# EAGLE design Noctua2 (EAGLE 9.6.2)
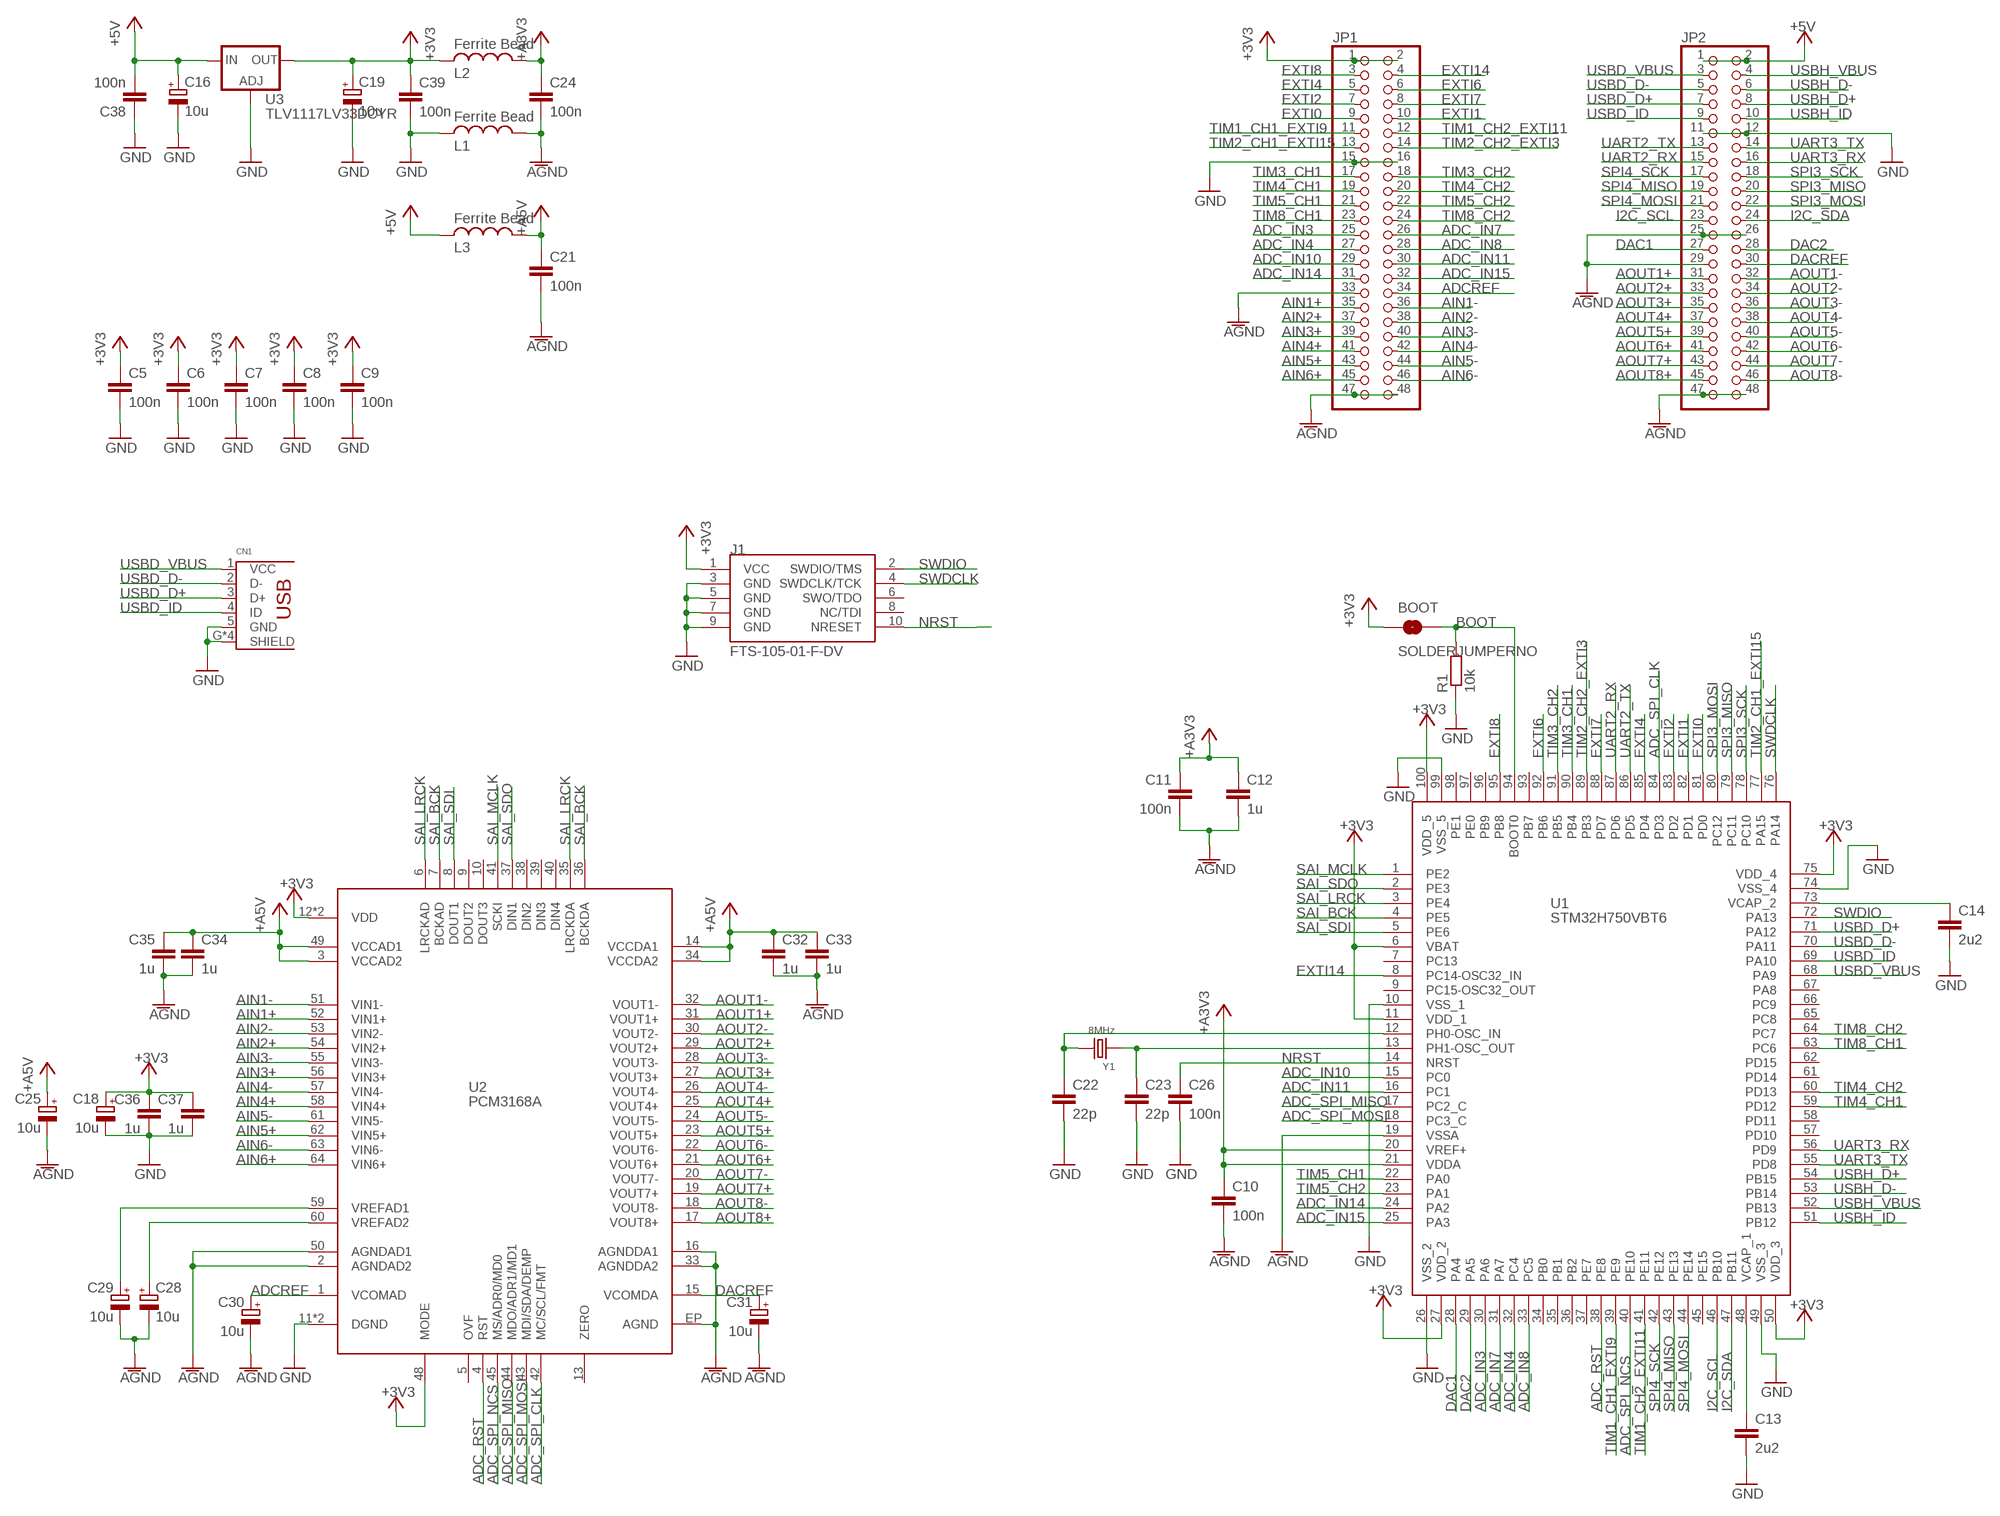
[diagram p0: schematic, sheet 1]

## Parts
BOOT  SOLDERJUMPERNO  [SJ_2S-NO]
C5  100n  C-EUC0603  [C0603]
C6  100n  C-EUC0603  [C0603]
C7  100n  C-EUC0603  [C0603]
C8  100n  C-EUC0603  [C0603]
C9  100n  C-EUC0603  [C0603]
C10  100n  C-EUC0603  [C0603]
C11  100n  C-EUC0603  [C0603]
C12  1u  C-EUC0603  [C0603]
C13  2u2  C-EUC0603  [C0603]
C14  2u2  C-EUC0603  [C0603]
C16  10u  CPOL-EUUD-4X5,8  [UD-4X5,8_NICHICON]
C18  10u  CPOL-EUUD-4X5,8  [UD-4X5,8_NICHICON]
C19  10u  CPOL-EUUD-4X5,8  [UD-4X5,8_NICHICON]
C21  100n  C-EUC0603  [C0603]
C22  22p  C-EUC0603  [C0603]
C23  22p  C-EUC0603  [C0603]
C24  100n  C-EUC0603  [C0603]
C25  10u  CPOL-EUUD-4X5,8  [UD-4X5,8_NICHICON]
C26  100n  C-EUC0603  [C0603]
C28  10u  CPOL-EUUD-4X5,8  [UD-4X5,8_NICHICON]
C29  10u  CPOL-EUUD-4X5,8  [UD-4X5,8_NICHICON]
C30  10u  CPOL-EUUD-4X5,8  [UD-4X5,8_NICHICON]
C31  10u  CPOL-EUUD-4X5,8  [UD-4X5,8_NICHICON]
C32  1u  C-EUC0603  [C0603]
C33  1u  C-EUC0603  [C0603]
C34  1u  C-EUC0603  [C0603]
C35  1u  C-EUC0603  [C0603]
C36  1u  C-EUC0603  [C0603]
C37  1u  C-EUC0603  [C0603]
C38  100n  C-EUC0603  [C0603]
C39  100n  C-EUC0603  [C0603]
CN1  USB_HRS_ZX62-B-5PA(11)MICRO.B  [HRS_ZX62RD-AB-5P8]
J1  FTS-105-01-F-DV  ARM_10SMD  [2X5_1.27MM_SMD]
JP1  PINHD-2X24  [2X24]
JP2  PINHD-2X24  [2X24]
L1  Ferrite Bead  INDUCTOR  [0603]
L2  Ferrite Bead  INDUCTOR  [0603]
L3  Ferrite Bead  INDUCTOR  [0603]
R1  10k  R-EU_0603  [0603@1]
U1  STM32H750VBT6  [QFP50P1600X1600X160-100N]
U2  PCM3168A  [PQFP64]
U3  TLV1117LV33DCYR  LD117AS33TR  [SOT223]
Y1  8MHz  SMD-CRYSTAL-8MHZ-20PF-20PPM(2P-5.0X3.2MM)  [X2-SMD-5.0X3.2X1.3MM]

## Nets
+3V3: BOOT.1 C5.1 C6.1 C7.1 C8.1 C9.1 C18.+ C19.+ C36.1 C37.1 C39.1 J1.1(VCC) JP1.1 JP1.2 L2.2 U1.6(VBAT) U1.11(VDD_1) U1.27(VDD_2) U1.50(VDD_3) U1.75(VDD_4) U1.100(VDD_5) U2.12(VDD) U2.46(VDD) U2.48(MODE) U3.4(OUT)
+5V: C16.+ C38.2 JP2.1 JP2.2 L3.2 U3.3(IN)
+A3V3: C10.1 C11.1 C12.1 C24.1 L2.1 U1.20(VREF+) U1.21(VDDA)
+A5V: C21.1 C25.+ C32.1 C33.1 C34.1 C35.1 L3.1 U2.3(VCCAD2) U2.14(VCCDA1) U2.34(VCCDA2) U2.49(VCCAD1)
ADC_IN3: JP1.25 U1.30(PA6)
ADC_IN4: JP1.27 U1.32(PC4)
ADC_IN7: JP1.26 U1.31(PA7)
ADC_IN8: JP1.28 U1.33(PC5)
ADC_IN10: JP1.29 U1.15(PC0)
ADC_IN11: JP1.30 U1.16(PC1)
ADC_IN14: JP1.31 U1.24(PA2)
ADC_IN15: JP1.32 U1.25(PA3)
ADC_RST: U1.38(PE8) U2.4(RST)
ADC_SPI_CLK: U1.84(PD3) U2.42(MC/SCL/FMT)
ADC_SPI_MISO: U1.17(PC2_C) U2.44(MDO/ADR1/MD1)
ADC_SPI_MOSI: U1.18(PC3_C) U2.43(MDI/SDA/DEMP)
ADC_SPI_NCS: U1.40(PE10) U2.45(MS/ADR0/MD0)
ADCREF: C30.+ JP1.34 U2.1(VCOMAD)
AGND: C10.2 C11.2 C12.2 C21.2 C24.2 C25.- C28.- C29.- C30.- C31.- C32.2 C33.2 C34.2 C35.2 JP1.33 JP1.47 JP1.48 JP2.25 JP2.26 JP2.29 JP2.47 JP2.48 L1.1 U1.19(VSSA) U2.2(AGNDAD2) U2.16(AGNDDA1) U2.33(AGNDDA2) U2.50(AGNDAD1) U2.EP(AGND)
AIN1+: JP1.35 U2.52(VIN1+)
AIN1-: JP1.36 U2.51(VIN1-)
AIN2+: JP1.37 U2.54(VIN2+)
AIN2-: JP1.38 U2.53(VIN2-)
AIN3+: JP1.39 U2.56(VIN3+)
AIN3-: JP1.40 U2.55(VIN3-)
AIN4+: JP1.41 U2.58(VIN4+)
AIN4-: JP1.42 U2.57(VIN4-)
AIN5+: JP1.43 U2.62(VIN5+)
AIN5-: JP1.44 U2.61(VIN5-)
AIN6+: JP1.45 U2.64(VIN6+)
AIN6-: JP1.46 U2.63(VIN6-)
AOUT1+: JP2.31 U2.31(VOUT1+)
AOUT1-: JP2.32 U2.32(VOUT1-)
AOUT2+: JP2.33 U2.29(VOUT2+)
AOUT2-: JP2.34 U2.30(VOUT2-)
AOUT3+: JP2.35 U2.27(VOUT3+)
AOUT3-: JP2.36 U2.28(VOUT3-)
AOUT4+: JP2.37 U2.25(VOUT4+)
AOUT4-: JP2.38 U2.26(VOUT4-)
AOUT5+: JP2.39 U2.23(VOUT5+)
AOUT5-: JP2.40 U2.24(VOUT5-)
AOUT6+: JP2.41 U2.21(VOUT6+)
AOUT6-: JP2.42 U2.22(VOUT6-)
AOUT7+: JP2.43 U2.19(VOUT7+)
AOUT7-: JP2.44 U2.20(VOUT7-)
AOUT8+: JP2.45 U2.17(VOUT8+)
AOUT8-: JP2.46 U2.18(VOUT8-)
BOOT: BOOT.2 R1.2 U1.94(BOOT0)
DAC1: JP2.27 U1.28(PA4)
DAC2: JP2.28 U1.29(PA5)
DACREF: C31.+ JP2.30 U2.15(VCOMDA)
EXTI0: JP1.9 U1.81(PD0)
EXTI1: JP1.10 U1.82(PD1)
EXTI2: JP1.7 U1.83(PD2)
EXTI4: JP1.5 U1.85(PD4)
EXTI6: JP1.6 U1.92(PB6)
EXTI7: JP1.8 U1.88(PD7)
EXTI8: JP1.3 U1.95(PB8)
EXTI14: JP1.4 U1.8(PC14-OSC32_IN)
GND: C5.2 C6.2 C7.2 C8.2 C9.2 C13.2 C14.2 C16.- C18.- C19.- C22.2 C23.2 C26.2 C36.2 C37.2 C38.1 C39.2 CN1.5(GND) CN1.G2(SHIELD) CN1.G3(SHIELD) CN1.G4(SHIELD) CN1.G(SHIELD) J1.3(GND) J1.5(GND) J1.7(GND) J1.9(GND) JP1.15 JP1.16 JP2.11 JP2.12 L1.2 R1.1 U1.10(VSS_1) U1.26(VSS_2) U1.49(VSS_3) U1.74(VSS_4) U1.99(VSS_5) U2.11(DGND) U2.47(DGND) U3.1(ADJ)
I2C_SCL: JP2.23 U1.46(PB10)
I2C_SDA: JP2.24 U1.47(PB11)
N$2: C28.+ U2.60(VREFAD2)
N$6: C13.1 U1.48(VCAP_1)
N$12: C23.1 U1.13(PH1-OSC_OUT) Y1.1
N$15: C22.1 U1.12(PH0-OSC_IN) Y1.2
N$19: C14.1 U1.73(VCAP_2)
NRST: C26.1 J1.10(NRESET) U1.14(NRST)
SAI_BCK: U1.4(PE5) U2.7(BCKAD) U2.36(BCKDA)
SAI_LRCK: U1.3(PE4) U2.6(LRCKAD) U2.35(LRCKDA)
SAI_MCLK: U1.1(PE2) U2.41(SCKI)
SAI_SDI: U1.5(PE6) U2.8(DOUT1)
SAI_SDO: U1.2(PE3) U2.37(DIN1)
SPI3_MISO: JP2.20 U1.79(PC11)
SPI3_MOSI: JP2.22 U1.80(PC12)
SPI3_SCK: JP2.18 U1.78(PC10)
SPI4_MISO: JP2.19 U1.43(PE13)
SPI4_MOSI: JP2.21 U1.44(PE14)
SPI4_SCK: JP2.17 U1.42(PE12)
SWDCLK: J1.4(SWDCLK/TCK) U1.76(PA14)
SWDIO: J1.2(SWDIO/TMS) U1.72(PA13)
TIM1_CH1_EXTI9: JP1.11 U1.39(PE9)
TIM1_CH2_EXTI11: JP1.12 U1.41(PE11)
TIM2_CH1_EXTI15: JP1.13 U1.77(PA15)
TIM2_CH2_EXTI3: JP1.14 U1.89(PB3)
TIM3_CH1: JP1.17 U1.90(PB4)
TIM3_CH2: JP1.18 U1.91(PB5)
TIM4_CH1: JP1.19 U1.59(PD12)
TIM4_CH2: JP1.20 U1.60(PD13)
TIM5_CH1: JP1.21 U1.22(PA0)
TIM5_CH2: JP1.22 U1.23(PA1)
TIM8_CH1: JP1.23 U1.63(PC6)
TIM8_CH2: JP1.24 U1.64(PC7)
UART2_RX: JP2.15 U1.87(PD6)
UART2_TX: JP2.13 U1.86(PD5)
UART3_RX: JP2.16 U1.56(PD9)
UART3_TX: JP2.14 U1.55(PD8)
USBD_D+: CN1.3(D+) JP2.7 U1.71(PA12)
USBD_D-: CN1.2(D-) JP2.5 U1.70(PA11)
USBD_ID: CN1.4(ID) JP2.9 U1.69(PA10)
USBD_VBUS: CN1.1(VCC) JP2.3 U1.68(PA9)
USBH_D+: JP2.8 U1.54(PB15)
USBH_D-: JP2.6 U1.53(PB14)
USBH_ID: JP2.10 U1.51(PB12)
USBH_VBUS: JP2.4 U1.52(PB13)
VREF_ADC: C29.+ U2.59(VREFAD1)
Unconnected: J1.6(SWO/TDO) J1.8(NC/TDI) U1.7(PC13) U1.9(PC15-OSC32_OUT) U1.34(PB0) U1.35(PB1) U1.36(PB2) U1.37(PE7) U1.45(PE15) U1.57(PD10) U1.58(PD11) U1.61(PD14) U1.62(PD15) U1.65(PC8) U1.66(PC9) U1.67(PA8) U1.93(PB7) U1.96(PB9) U1.97(PE0) U1.98(PE1) U2.5(OVF) U2.9(DOUT2) U2.10(DOUT3) U2.13(ZERO) U2.38(DIN2) U2.39(DIN3) U2.40(DIN4)

## Library data of the parts
BOOT = SparkFun:SOLDERJUMPER: Solder Jumper Standard SMD solder jumper. Used to automate production. Two varients : Normally Open and Normally Closed are the same, but have different paste layers. NC will have a large amount of paste and should jumper during reflow.
C5-C14 C21-C24 C26 C32-C39 = Rebel:C-EU: CAPACITOR, European symbol
C16 C18 C19 C25 C28-C31 = Rebel:CPOL-EU: POLARIZED CAPACITOR, European symbol
CN1 = Rebel:USB_HRS_ZX62-B-5PA(11)MICRO.B
J1 = borkedlabs-connectors:ARM_10; PACKAGE: 2x5_1.27MM_SMD
JP1 JP2 = pinhead:PINHD-2X24: PIN HEADER
L1-L3 = Rebel:INDUCTOR; OC_FARNELL: 2288736
R1 = Rebel:R-EU_: RESISTOR, European symbol
U1 = SamacSys_Parts:STM32H750VBT6: ARM Microcontrollers - MCU High-performance and DSP with DP-FPU, Arm Cortex-M7 MCU with 128 Kbytes of Flash memory, 1MB RAM, 400 MHz CPU, L1 cache, external memory interface, JPEG codec, HW crypto, large set of peripherals Source: Datasheet <https://www.st.com/resource/en/datasheet/stm32h750vb.pdf>; DESCRIPTION: ARM Microcontrollers - MCU High-performance and DSP with DP-FPU, Arm Cortex-M7 MCU with 128 Kbytes of Flash memory, 1MB RAM, 400 MHz CPU, L1 cache, external memory interface, JPEG codec, HW crypto, large set of peripherals; HEIGHT: 1.6mm; MANUFACTURER_NAME: STMicroelectronics; MANUFACTURER_PART_NUMBER: STM32H750VBT6; MOUSER_PART_NUMBER: 511-STM32H750VBT6; MOUSER_PRICE-STOCK: https://www.mouser.com/Search/Refine.aspx?Keyword=511-STM32H750VBT6
U2 = Rebel:PCM3168A
U3 = v-reg:LD117A?*: Low drop fixed and adjustable positive voltage regulators 1 A Source: http://www.st.com/stonline/products/literature/ds/7194/ld1117axx.pdf
Y1 = Seeed-OPL-crystal-osctllator:SMD-CRYSTAL-8MHZ-20PF-20PPM(2P-5.0X3.2MM): 306010004; MPN: 5032/2P; VALUE: 5032/2p

## Net classes
1 power: width 0.178 mm, drill 0.305 mm, clearance 0.178 mm to class 0, clearance 0.178 mm

## Board
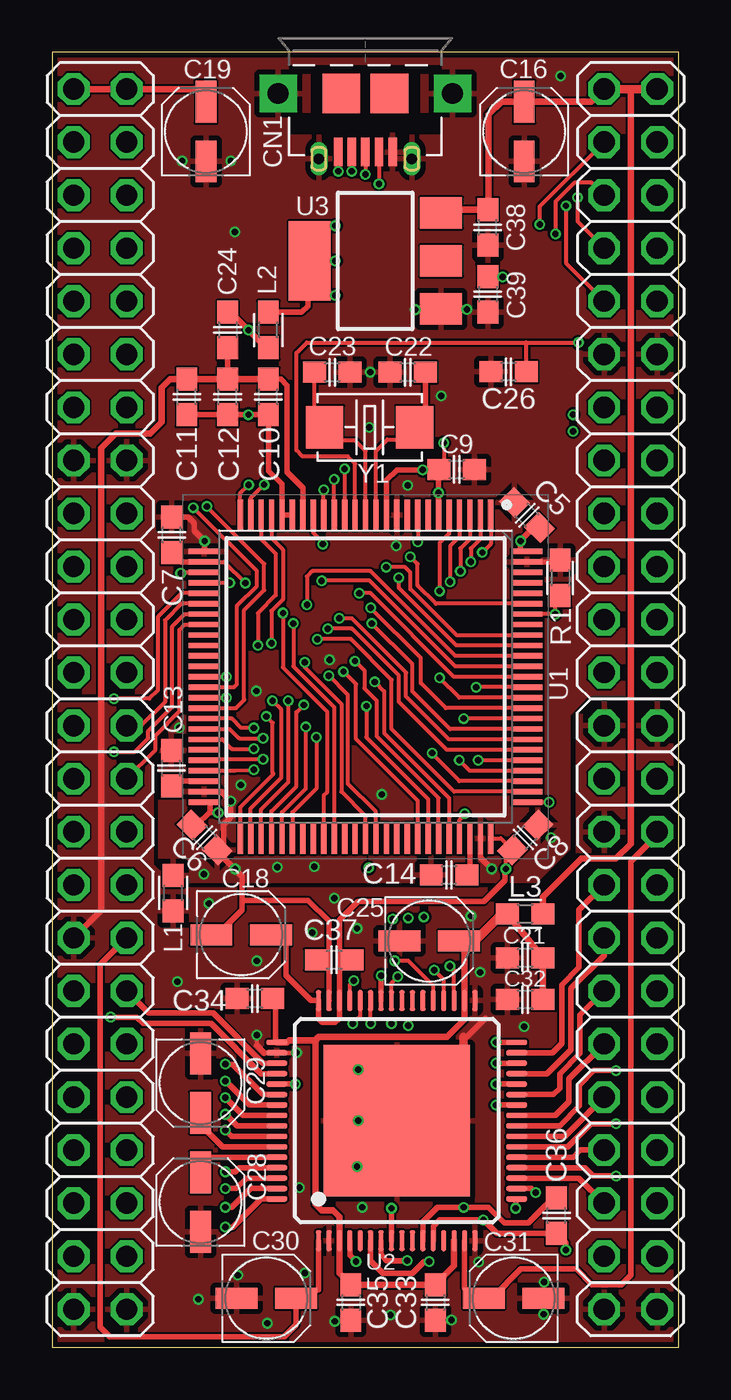
[diagram p1: board, top side]
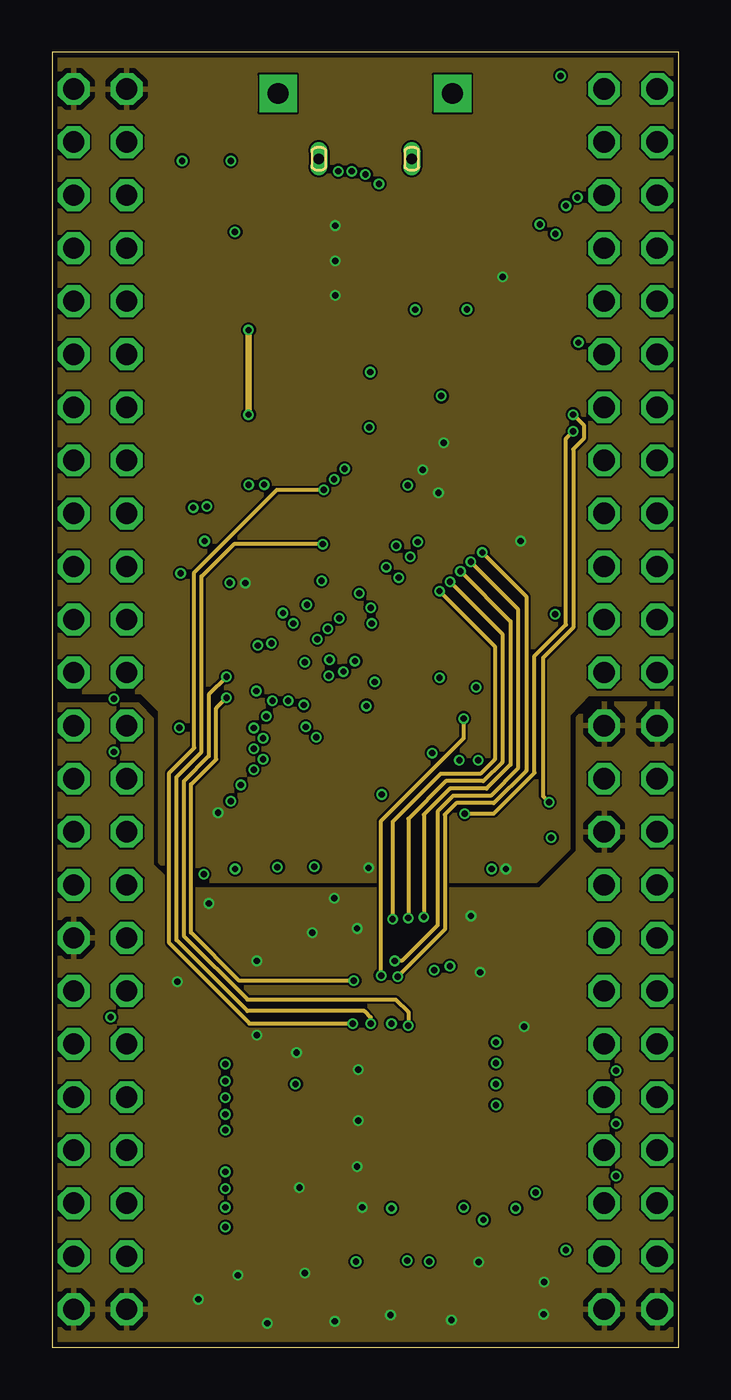
[diagram p2: board, inner layer InnerTop]
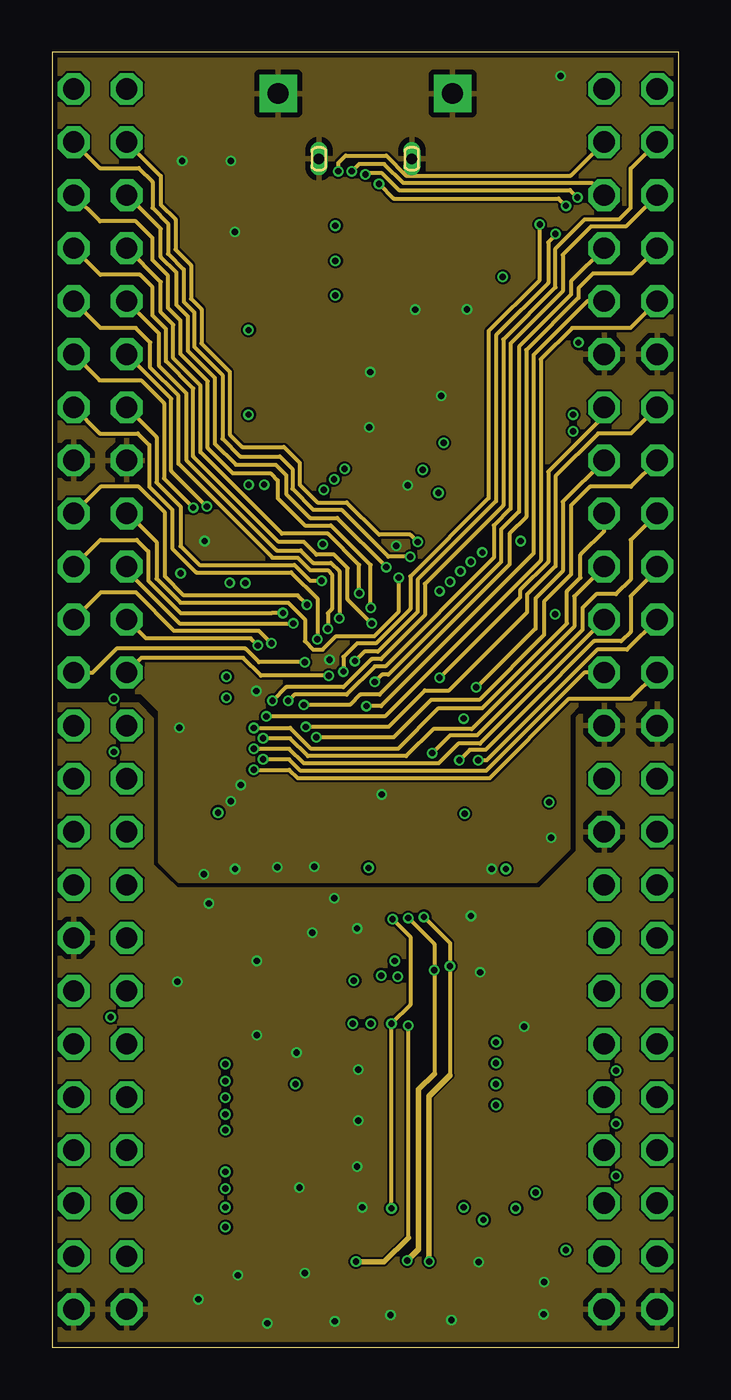
[diagram p3: board, inner layer InnerBottom]
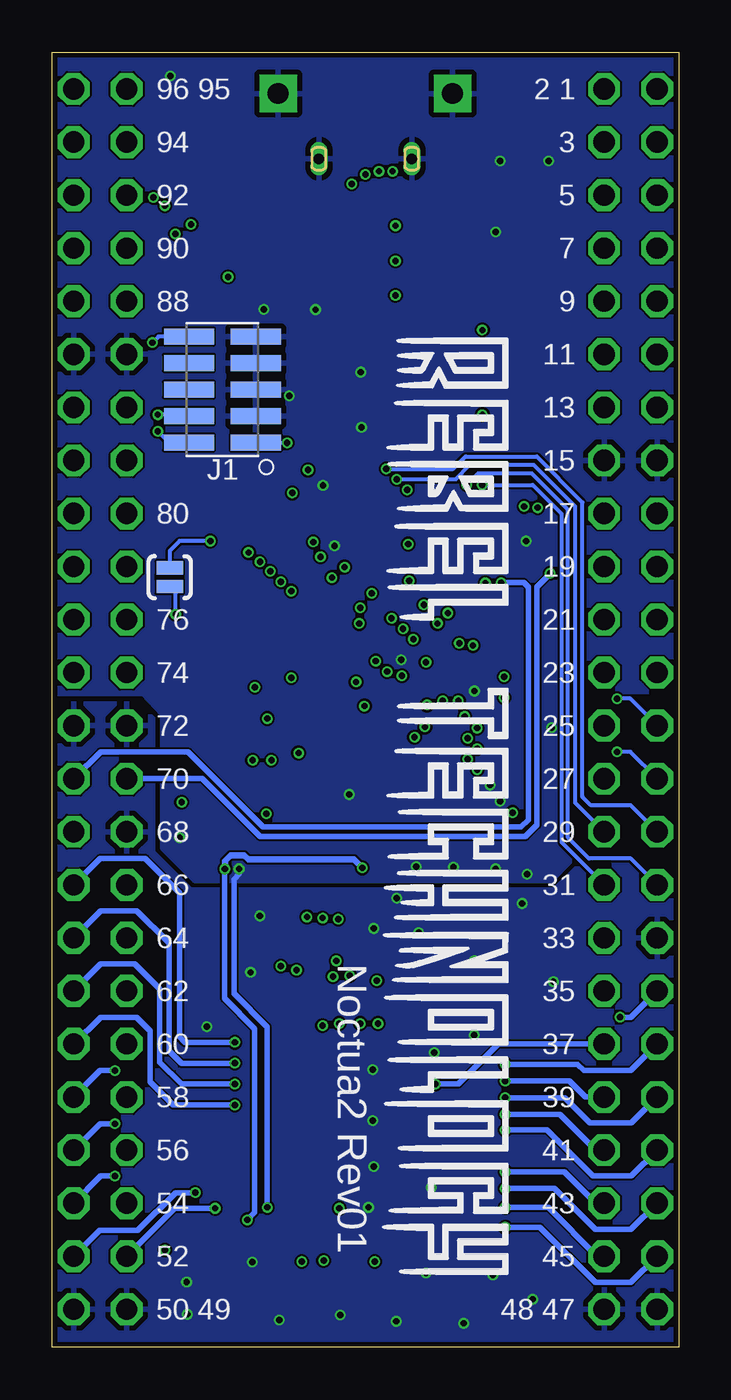
[diagram p4: board, bottom side, seen from below]

Size 30 x 62 mm. Coordinates in mm from the lower left corner, seen from the top.
Outline: 0,0 30,0 30,62 0,62 0,0
Copper layers (1*2*15*16): Top 0.035mm / dielectric 0.2mm / InnerTop 0.0175mm / dielectric 0.3mm / InnerBottom 0.0175mm / dielectric 0.2mm / Bottom 0.035mm
Design rules "PCBWay_4layer_20210129": minimum track width 0.1mm, minimum drill 0.2mm, track to track 0.1mm, track to pad 0.1mm, pad to pad 0.1mm, via to via 0.1mm, smd to smd 0mil, copper to edge 10mil, drill to drill 8mil, minimum pad ring 6mil, minimum via ring 4mil, stop-mask expansion 4mil, vias tented up to drill 25mil, thermal gap 10mil

### Footprints (pad centres in the part's own frame; a part is rotated, then mirrored left to right if it is on the bottom)
SJ_2S-NO = smd 0.635 x 1.27: 1 -0.45,0; 2 0.45,0
C0603 = smd 1.1 x 1: 1 -0.85,0; 2 0.85,0
UD-4X5,8_NICHICON = smd 2 x 1: + 1.425,0; - -1.425,0
HRS_ZX62RD-AB-5P8 = smd 0.4 x 1.35: 1 1.3,2.275; 2 0.65,2.275; 3 0,2.275; 4 -0.65,2.275; 5 -1.3,2.275 | smd 1.8 x 1.9: D_0 -1.15,-0.525; D_1 1.15,-0.525 | drill 1 pad 1.8 square: G -4.175,-0.525; G2 4.175,-0.525 | drill 0.5 long: G3 -2.225,2.6; G4 2.225,2.6
2X5_1.27MM_SMD = smd 2.4 x 0.76: 1 -1.6,2.54; 2 1.6,2.54; 3 -1.6,1.27; 4 1.6,1.27; 5 -1.6,0; 6 1.6,0; 7 -1.6,-1.27; 8 1.6,-1.27; 9 -1.6,-2.54; 10 1.6,-2.54
2X24 = drill 1.016 octagon: 1 -27.94,-1.27; 2 -27.94,1.27; 3 -25.4,-1.27; 4 -25.4,1.27; 5 -22.86,-1.27; 6 -22.86,1.27; 7 -20.32,-1.27; 8 -20.32,1.27; 9 -17.78,-1.27; 10 -17.78,1.27; 11 -15.24,-1.27; 12 -15.24,1.27; 13 -12.7,-1.27; 14 -12.7,1.27; 15 -10.16,-1.27; 16 -10.16,1.27; 17 -7.62,-1.27; 18 -7.62,1.27; 19 -5.08,-1.27; 20 -5.08,1.27; 21 -2.54,-1.27; 22 -2.54,1.27; 23 0,-1.27; 24 0,1.27; 25 2.54,-1.27; 26 2.54,1.27; 27 5.08,-1.27; 28 5.08,1.27; 29 7.62,-1.27; 30 7.62,1.27; 31 10.16,-1.27; 32 10.16,1.27; 33 12.7,-1.27; 34 12.7,1.27; 35 15.24,-1.27; 36 15.24,1.27; 37 17.78,-1.27; 38 17.78,1.27; 39 20.32,-1.27; 40 20.32,1.27; 41 22.86,-1.27; 42 22.86,1.27; 43 25.4,-1.27; 44 25.4,1.27; 45 27.94,-1.27; 46 27.94,1.27; 47 30.48,-1.27; 48 30.48,1.27
0603 = smd 1.1 x 1: 1 -0.85,0; 2 0.85,0
0603@1 = smd 1.1 x 1: 1 -0.85,0; 2 0.85,0
QFP50P1600X1600X160-100N = smd 1.475 x 0.254: 1 -7.738,6; 2 -7.738,5.5; 3 -7.738,5; 4 -7.738,4.5; 5 -7.738,4; 6 -7.738,3.5; 7 -7.738,3; 8 -7.738,2.5; 9 -7.738,2; 10 -7.738,1.5; 11 -7.738,1; 12 -7.738,0.5; 13 -7.738,0; 14 -7.738,-0.5; 15 -7.738,-1; 16 -7.738,-1.5; 17 -7.738,-2; 18 -7.738,-2.5; 19 -7.738,-3; 20 -7.738,-3.5; 21 -7.738,-4; 22 -7.738,-4.5; 23 -7.738,-5; 24 -7.738,-5.5; 25 -7.738,-6; 51 7.738,-6; 52 7.738,-5.5; 53 7.738,-5; 54 7.738,-4.5; 55 7.738,-4; 56 7.738,-3.5; 57 7.738,-3; 58 7.738,-2.5; 59 7.738,-2; 60 7.738,-1.5; 61 7.738,-1; 62 7.738,-0.5; 63 7.738,0; 64 7.738,0.5; 65 7.738,1; 66 7.738,1.5; 67 7.738,2; 68 7.738,2.5; 69 7.738,3; 70 7.738,3.5; 71 7.738,4; 72 7.738,4.5; 73 7.738,5; 74 7.738,5.5; 75 7.738,6 | smd 0.254 x 1.475: 26 -6,-7.738; 27 -5.5,-7.738; 28 -5,-7.738; 29 -4.5,-7.738; 30 -4,-7.738; 31 -3.5,-7.738; 32 -3,-7.738; 33 -2.5,-7.738; 34 -2,-7.738; 35 -1.5,-7.738; 36 -1,-7.738; 37 -0.5,-7.738; 38 0,-7.738; 39 0.5,-7.738; 40 1,-7.738; 41 1.5,-7.738; 42 2,-7.738; 43 2.5,-7.738; 44 3,-7.738; 45 3.5,-7.738; 46 4,-7.738; 47 4.5,-7.738; 48 5,-7.738; 49 5.5,-7.738; 50 6,-7.738; 76 6,7.738; 77 5.5,7.738; 78 5,7.738; 79 4.5,7.738; 80 4,7.738; 81 3.5,7.738; 82 3,7.738; 83 2.5,7.738; 84 2,7.738; 85 1.5,7.738; 86 1,7.738; 87 0.5,7.738; 88 0,7.738; 89 -0.5,7.738; 90 -1,7.738; 91 -1.5,7.738; 92 -2,7.738; 93 -2.5,7.738; 94 -3,7.738; 95 -3.5,7.738; 96 -4,7.738; 97 -4.5,7.738; 98 -5,7.738; 99 -5.5,7.738; 100 -6,7.738
PQFP64 = smd 0.25 x 1: 1 -3.75,-5.75; 2 -3.25,-5.75; 3 -2.75,-5.75; 4 -2.25,-5.75; 5 -1.75,-5.75; 6 -1.25,-5.75; 7 -0.75,-5.75; 8 -0.25,-5.75; 9 0.25,-5.75; 10 0.75,-5.75; 11 1.25,-5.75; 12 1.75,-5.75; 13 2.25,-5.75; 14 2.75,-5.75; 15 3.25,-5.75; 16 3.75,-5.75; 33 3.75,5.75; 34 3.25,5.75; 35 2.75,5.75; 36 2.25,5.75; 37 1.75,5.75; 38 1.25,5.75; 39 0.75,5.75; 40 0.25,5.75; 41 -0.25,5.75; 42 -0.75,5.75; 43 -1.25,5.75; 44 -1.75,5.75; 45 -2.25,5.75; 46 -2.75,5.75; 47 -3.25,5.75; 48 -3.75,5.75 | smd 1 x 0.25: 17 5.75,-3.75; 18 5.75,-3.25; 19 5.75,-2.75; 20 5.75,-2.25; 21 5.75,-1.75; 22 5.75,-1.25; 23 5.75,-0.75; 24 5.75,-0.25; 25 5.75,0.25; 26 5.75,0.75; 27 5.75,1.25; 28 5.75,1.75; 29 5.75,2.25; 30 5.75,2.75; 31 5.75,3.25; 32 5.75,3.75; 49 -5.75,3.75; 50 -5.75,3.25; 51 -5.75,2.75; 52 -5.75,2.25; 53 -5.75,1.75; 54 -5.75,1.25; 55 -5.75,0.75; 56 -5.75,0.25; 57 -5.75,-0.25; 58 -5.75,-0.75; 59 -5.75,-1.25; 60 -5.75,-1.75; 61 -5.75,-2.25; 62 -5.75,-2.75; 63 -5.75,-3.25; 64 -5.75,-3.75 | smd 7 x 7.26: EP 0,0
SOT223 = smd 1.5 x 2: 1 -2.3,-3.15; 2 0,-3.15; 3 2.3,-3.15 | smd 3.8 x 2: 4 0,3.15
X2-SMD-5.0X3.2X1.3MM = smd 1.778 x 2.032: 1 -2.159,0; 2 2.159,0

### Placement (x,y rotation side)
BOOT  24.38,36.87 270 bottom
C5  22.73,39.84 135 top
C6  7.3,24.4 315 top
C7  5.73,38.89 90 top
C8  22.65,24.4 45 top
C9  19.36,42.03 0 top
C10  10.35,45.5 90 top
C11  6.45,45.5 90 top
C12  8.4,45.5 90 top
C13  5.71,27.73 90 top
C14  19,22.61 180 top
C16  22.6,58.2 90 top
C18  9.05,19.75 0 top
C19  7.36,58.2 90 top
C21  22.65,18.65 180 top
C22  17.02,46.68 180 top
C23  13.41,46.68 0 top
C24  8.4,48.7 270 top
C25  18.05,19.45 0 top
C26  21.85,46.7 180 top
C28  7.1,6.95 90 top
C29  7.1,12.65 270 top
C30  10.25,2.35 0 top
C31  22.1,2.35 180 top
C32  22.65,16.65 180 top
C33  18.35,2.15 270 top
C34  9.7,16.7 180 top
C35  14.3,2.15 270 top
C36  24.15,6.3 90 top
C37  13.5,18.55 180 top
C38  20.86,53.62 90 top
C39  20.86,50.42 270 top
CN1  15,59.5 180 top
J1  21.85,45.85 180 bottom
JP1  2.3,32.3 270 top
JP2  27.7,32.3 270 top
L1  5.8,21.75 90 top
L2  10.35,48.7 90 top
L3  22.65,20.75 0 top
R1  24.32,36.83 270 top
U1  15,32.1 270 top
U2  16.5,10.85 0 top
U3  15.47,52.01 90 top
Y1  15.2,44.04 0 top

### Tracks (layer width: path | path; a pad name or v marks a point on that pad's centre or on a via)
+3V3  (via drill 0.3)
  Top 0.2: U1.27 8.24,37.6 v9.25,36.59 | U1.75 21.49,24.36 C8.1 21.73,23.48 v21.73,22.9 | v18.75,43.3 18.75,42.2 18.5,41.95
  Top 0.254: C5.1 23.04,39.24 22.43,38.63 v22.43,38.6 22.43,38.17 22.49,38.1 U1.100 | 7.55,25.62 7.55,26.1 U1.50 | 7.55,25.62 6.93,25 C6.1 | U2.12 18.25,5.8 18.55,6.1 v20.65,6.1 21.3,5.45 C36.1 24.6,5 v24.6,4.65 | 13.75,18.55 U2.46 13.75,15.75 13.55,15.55 12.95,15.55 12.75,15.75 U2.48 12.4,16.6 11.2,17.8 11.2,19.65 10.75,19.65 C18.+ | C37.1 13.75,18.55 | U1.11 16,41.51 16.5,42 v17.75,42 18.38,42.02 C9.1 18.5,42.01 18.5,41.95 v18.5,40.9 U1.6 | U1.27 6.17,37.6 C7.1 | 7.55,25.62 7.57,25.6 v7.94,25.6 | L2.2 11.95,49.55 12.25,49.85 12.25,51.94 U3.4 | v21.73,22.9 21.68,22.85 21.68,22.35 20.68,21.35 14.65,21.35 13.75,20.45 13.75,18.55
  Top 0.305: JP1.1 JP1.2 7.29,60.24 7.35,60.3 7.36,60.29 C19.+
  Top 0.4: v13.56,50.36 13.09,50.36
  Top 0.406: v13.56,53.7 12.77,53.7 12.03,52.96 12.03,52.3 U3.4 v13.56,52.01 | v21.58,51.24 20.86,51.24 C39.1
  Bottom 0.152: J1.1
  Bottom 0.2: v22.43,38.6 23.9,38.6 24.38,38.12 BOOT.1 | J1.1 v18.75,43.3
  Bottom 0.254: v20.65,6.1 20.3,6.45 20.3,15.25 21.75,16.7 21.75,22.88 v21.73,22.9
  Bottom 0.305: v21.73,22.9 21.73,23.27 21.45,23.55 20.8,23.55 20.6,23.35 15.55,23.35 v15.15,22.95
  pour InnerTop: 0,62 30,62 30,31.3 25.65,31.3 24.7,30.3 24.7,23.9 23.15,22.35 6.1,22.35 5.2,23.25 5.2,30.5 4.3,31.4 0,31.4
+5V
  Top 0.254: 23.5,20.85 L3.2
  Top 0.305: JP2.1 25.81,59.62 C16.+ 21.52,59.62 20.9,59 20.9,54.51 C38.2 18.61,54.47 18.54,54.39 | 23.5,20.85 23.5,21.55 25.35,23.4 27,23.4 27.7,24.1 27.7,60.23
  Top 0.406: JP2.1 27.69,60.24 27.7,60.23 27.71,60.24 JP2.2 | U3.3 18.54,54.39
+A3V3  (via drill 0.3)
  Top 0.254: C11.1 C12.1 v9.4,44.65 C10.1 10.35,41.95 11,41.34 U1.21 U1.20 | C24.1 8.55,49.55 v9.4,48.7 10.25,47.85 L2.1
  InnerTop 0.305: v9.4,48.7 v9.4,44.65
+A5V
  Top 0.254: 19.75,19.15 C25.+ | U2.49 10.7,14.6 10.7,16.57 C34.1
  Top 0.305: U2.14 19.25,3.9 C33.1 C35.1 13.75,3.55 U2.3 13.75,6.25 13.45,6.55 12.9,6.55 12.6,6.85 12.6,14.7 | 19.75,19.15 U2.34 19.75,15.7 18.9,14.85 12.75,14.85 12.6,14.7 | C32.1 C21.1 L3.1 | 12.6,14.7 11.35,14.7 11.25,14.6 U2.49
  Top 0.406: C25.+ 19.52,19.49 20.27,19.49 21.53,20.75 L3.1
ADC_IN3  (via drill 0.3)
  Top 0.2: U1.30 6.2,36.1 5.05,34.95 5.05,31.45 4.65,31.05 v2.95,31.05
  Bottom 0.2: JP1.25 2.32,31.05 v2.95,31.05
ADC_IN4  (via drill 0.3)
  Top 0.2: v2.95,28.5 3.95,28.5 4.6,29.15 4.6,29.5 5.75,30.65 5.75,34.5 6.35,35.1 U1.32
  Bottom 0.2: JP1.27 2.31,28.5 v2.95,28.5
ADC_IN7
  Top 0.2: U1.31 6.2,35.6 5.4,34.8 5.4,30.89 4.27,29.76 JP1.26
ADC_IN8
  Top 0.2: U1.33 6.35,34.6 6.1,34.35 6.1,30.45 4.95,29.3 4.95,28.6 JP1.28
ADC_IN10  (via drill 0.3)
  Top 0.2: v14,42.05 U1.15
  Bottom 0.2: JP1.29 2.3,25.95 4.2,25.95 4.6,26.35 4.6,40.45 6.8,42.65 10.2,42.65 10.8,42.05 v14,42.05
ADC_IN11  (via drill 0.3)
  Top 0.2: U1.16 v13.5,41.55
  Bottom 0.2: JP1.30 4.95,26.06 4.95,40.25 6.95,42.25 10,42.25 10.7,41.55 v13.5,41.55
ADC_IN14  (via drill 0.3)
  Top 0.2: v10.15,41.3 9.5,40.66 U1.24
  Bottom 0.2: JP1.31 2.29,23.4 4.3,23.4 5.3,24.4 5.3,40.1 7.05,41.85 9.6,41.85 v10.15,41.3
ADC_IN15  (via drill 0.3)
  Top 0.2: v9.4,41.29 9,40.89 U1.25
  Bottom 0.2: JP1.32 5.6,24.17 5.6,39.9 6.99,41.29 v9.4,41.29
ADC_RST  (via drill 0.3)
  Top 0.2: v8.35,32.1 U1.38
  Top 0.254: U2.4 14.25,4.4 v14.55,4.1
  InnerTop 0.2: v8.35,32.1 7.5,31.25 7.5,28.3 6.3,27.1 6.3,19.7 9.35,16.65 16.45,16.65 17.05,16.05 v17.05,15.4
  InnerBottom 0.2: 17.05,5.25 v17.05,15.4
  InnerBottom 0.254: v14.55,4.1 15.9,4.1 17.05,5.25
ADC_SPI_CLK  (via drill 0.3)
  Top 0.2: U1.84 v19.7,30.1
  Top 0.254: U2.42 v15.75,17.8
  InnerTop 0.2: v19.7,30.1 19.7,29.15 15.75,25.2 v15.75,17.8
ADC_SPI_MISO  (via drill 0.3)
  Top 0.2: U2.44 14.75,15.85 v14.4,15.5 | U1.17 v13,41.05
  InnerTop 0.2: v14.4,15.5 9.45,15.5 5.6,19.35 5.6,27.5 6.8,28.7 6.8,37.1 10.75,41.05 v13,41.05
ADC_SPI_MOSI  (via drill 0.3)
  Top 0.2: v15.25,15.5 U2.43 | U1.18 12.5,38.99 12.96,38.54 v12.96,38.45
  InnerTop 0.2: v15.25,15.5 15.25,15.8 14.95,16.1 9.35,16.1 5.95,19.5 5.95,27.3 7.15,28.5 7.15,36.9 8.7,38.45 v12.96,38.45
ADC_SPI_NCS  (via drill 0.3)
  Top 0.2: U2.45 14.25,17.35 v14.45,17.55 | U1.40 v8.35,31.1
  InnerTop 0.2: v14.45,17.55 8.95,17.55 6.65,19.85 6.65,26.95 7.85,28.15 7.85,30.6 v8.35,31.1
ADCREF
  Top 0.254: U2.1 12.75,2.74 11.99,2.35 C30.+ 11.67,1.07 11.1,0.5 2.75,0.5 2.3,0.95 2.3,18.33 JP1.34
AGND  (via drill 0.3)
  Top 0.2: v11.7,14.1 U2.50 10.15,14.1 | 9.8,14.45 v9.8,14.95
  Top 0.254: 19.7,14.85 19.85,14.85 20.75,15.75 | U2.EP 15.21,10.85 15.16,10.89 v14.65,10.85 | C12.2 C24.2 | U1.19 12,41.15 11.25,41.9 11.25,46.05 10.95,46.35 10.3,46.35
  Top 0.3: 10.15,14.1 9.8,14.45
  Top 0.305: C10.2 10.3,46.35 C12.2 C11.2 5.65,46.35 5.25,45.95 5.25,44.3 4.7,43.75 3.05,43.75 2.35,43.05 2.35,20.92 JP1.33
  Top 0.406: 19.7,14.85 19.7,14.3
  other vias: 19.12,1.3 23.56,3.13 23.53,1.58 13.53,1.25 6.99,2.3 10.3,1.15 14.6,20.05 14.65,13.3 12.45,19.85 12.1,3.55 16.2,1.55 14.85,6.7 20.42,4.08 22.6,15.35 20.5,17.95 20.05,20.65 13.5,21.5 14.6,8.65 8.89,3.45 11.84,7.65 6,17.5 9.8,18.5 7.5,21.25
  pour Bottom: -0.42,30.75 4.1,30.75 4.75,30.07 4.75,23.07 5.95,21.9 23.4,21.9 25.2,23.7 25.2,30.1 25.9,30.8 30,30.8 30,-0.06 -0.5,0 -0.5,27.7
  pour Top: -0.42,30.75 4.1,30.75 4.75,30.07 4.75,23.07 5.95,21.9 23.4,21.9 25.2,23.7 25.2,30.1 25.9,30.8 30,30.8 30,-0.06 -0.5,0 -0.5,27.7
  pour InnerTop: -0.42,30.75 4.1,30.75 4.75,30.07 4.75,23.07 5.95,21.9 23.4,21.9 25.2,23.7 25.2,30.1 25.9,30.8 30,30.8 30,-0.06 -0.5,0 -0.5,27.7
  pour InnerBottom: -0.42,30.75 4.1,30.75 4.75,30.07 4.75,23.07 5.95,21.9 23.4,21.9 25.2,23.7 25.2,30.1 25.9,30.8 30,30.8 30,-0.06 -0.5,0 -0.5,27.7
AIN1+  (via drill 0.3)
  Top 0.254: v2.8,15.8 4.05,15.8 4.35,15.5 7.6,15.5 10,13.1 U2.52
  Bottom 0.254: JP1.35 2.29,15.8 v2.8,15.8
AIN1-
  Top 0.254: U2.51 10.1,13.6 7.7,16 4.63,16 JP1.36
AIN2+  (via drill 0.3)
  Top 0.254: U2.54 10.1,12.1 8.65,13.55 v8.3,13.55
  Bottom 0.254: v8.3,13.55 4.85,13.55 4.55,13.25 2.3,13.25 JP1.37
AIN2-  (via drill 0.3)
  Top 0.254: U2.53 v11.65,12.6
  Bottom 0.254: JP1.38 8.63,14.52 10.55,12.6 v11.65,12.6
AIN3+  (via drill 0.3)
  Top 0.254: U2.56 9.15,11.1 v8.3,11.95
  Bottom 0.254: v8.3,11.95 5.45,11.95 4.25,10.75 2.26,10.75 JP1.39
AIN3-  (via drill 0.3)
  Top 0.254: U2.55 9.45,11.6 v8.3,12.75
  Bottom 0.254: v8.3,12.75 5.24,12.75 4.47,11.98 JP1.40
AIN4+  (via drill 0.3)
  Top 0.254: U2.58 8.6,10.1 v8.3,10.4
  Bottom 0.254: v8.3,10.4 6.3,10.4 4.1,8.2 2.27,8.2 JP1.41
AIN4-  (via drill 0.3)
  Top 0.254: U2.57 8.85,10.6 v8.3,11.15
  Bottom 0.254: v8.3,11.15 5.68,11.15 3.97,9.44 JP1.42
AIN5+  (via drill 0.3)
  Top 0.254: U2.62 9.3,8.1 8.8,7.6 v8.3,7.6
  Bottom 0.254: v8.3,7.6 5.95,7.6 4,5.65 2.28,5.65 JP1.43
AIN5-  (via drill 0.3)
  Top 0.254: U2.61 8.95,8.6 8.75,8.4 v8.3,8.4
  Bottom 0.254: v8.3,8.4 5.47,8.4 3.97,6.9 JP1.44
AIN6+  (via drill 0.3)
  Top 0.254: U2.64 10,7.1 8.65,5.75 v8.3,5.75
  Bottom 0.254: JP1.45 2.29,3.1 4,3.1 6.65,5.75 v8.3,5.75
AIN6-  (via drill 0.3)
  Top 0.254: U2.63 9.5,7.6 8.6,6.7 v8.3,6.7
  Bottom 0.254: JP1.46 3.91,4.36 6.25,6.7 v8.3,6.7
AOUT1+
  Top 0.254: U2.31 23.95,14.1 24.4,14.55 24.4,17.36 25.23,18.19 25.23,20.94 JP2.31
AOUT1-  (via drill 0.3)
  Top 0.254: U2.32 v21.25,14.6
  Bottom 0.254: JP2.32 27.71,23.4 25.55,23.4 23.9,21.75 23.9,14.85 23.65,14.6 v21.25,14.6
AOUT2+
  Top 0.254: JP2.33 26.43,18.75 24.85,17.17 24.85,14.25 23.7,13.1 U2.29
AOUT2-  (via drill 0.3)
  Top 0.254: U2.30 v21.25,13.6
  Bottom 0.254: v21.25,13.6 23.8,13.6 24.4,14.2 24.4,19.35 25.95,20.9 27.67,20.9 JP2.34
AOUT3+
  Top 0.254: U2.27 24,12.1 24.3,12.4 24.3,13.08 25.28,14.06 25.28,15.91 JP2.35
AOUT3-  (via drill 0.3)
  Top 0.254: v21.25,12.6 U2.28
  Bottom 0.254: v21.25,12.6 23.8,12.6 24.85,13.65 24.85,17.15 26.05,18.35 27.68,18.35 JP2.36
AOUT4+
  Top 0.254: JP2.37 24.75,12.84 24.75,11.75 24.1,11.1 U2.25
AOUT4-  (via drill 0.3)
  Top 0.254: U2.26 v21.25,11.6
  Bottom 0.254: JP2.38 27.69,15.8 25.95,15.8 25.3,15.15 25.3,12.7 24.2,11.6 v21.25,11.6
AOUT5+
  Top 0.254: U2.23 24.55,10.1 JP2.39
AOUT5-  (via drill 0.3)
  Top 0.254: U2.24 24.3,10.6 25.25,11.55 25.25,12.55 25.95,13.25 v27,13.25
  Bottom 0.254: v27,13.25 27.7,13.25 JP2.40
AOUT6+
  Top 0.254: U2.21 24.95,9.1 25.3,9.45 JP2.41
AOUT6-  (via drill 0.3)
  Top 0.254: U2.22 24.7,9.6 25.8,10.7 v27,10.7
  Bottom 0.254: v27,10.7 27.71,10.7 JP2.42
AOUT7+
  Top 0.254: U2.19 25.23,8.1 JP2.43
AOUT7-  (via drill 0.3)
  Top 0.254: U2.20 25.5,8.6 25.9,8.2 v27,8.2
  Bottom 0.254: v27,8.2 27.67,8.2 JP2.44
AOUT8+  (via drill 0.3)
  Top 0.254: U2.17 22.2,7.1 v22.2,6.65
  Bottom 0.254: v22.2,6.65 24.14,6.65 JP2.45
AOUT8-  (via drill 0.3)
  Top 0.254: v23.15,7.4 22.95,7.6 U2.18
  Bottom 0.254: v23.15,7.4 24.1,7.4 25.9,5.6 27.73,5.6 JP2.46
BOOT  (via drill 0.3)
  Top 0.2: R1.2 24.22,35.98 24.09,35.85 v24.09,35.1 U1.94
  Bottom 0.2: v24.09,35.1 24.09,36.13 BOOT.2
DAC1  (via drill 0.3)
  Top 0.2: U1.28 6.2,37.1 v6.15,37.05
  Bottom 0.254: JP2.27 22.82,27.22 20.05,24.45 7.35,24.45 6.8,25 6.8,36.4 v6.15,37.05
DAC2  (via drill 0.3)
  Top 0.2: U1.29 v8.5,36.6
  Bottom 0.254: JP2.28 27.69,28.5 23.5,28.5 19.9,24.9 7.55,24.9 7.2,25.25 7.2,36.4 7.4,36.6 v8.5,36.6
DACREF
  Top 0.254: U2.15 19.75,2.85 20.2,2.4 20.7,2.4 C31.+ 21.05,2.35 22.45,3.75 25.1,3.75 25.85,3 27.25,3 27.7,3.45 27.7,23.26 28.97,24.53 JP2.30
EXTI0  (via drill 0.3)
  Top 0.2: v13.2,34.4 14.35,34.4 16.6,32.15 16.6,30.9 18.9,28.6 U1.81
  InnerBottom 0.2: v13.2,34.4 13.2,35.15 13.4,35.35 13.4,37 13.2,37.2 12.35,37.2 11.75,37.8 10.55,37.8 6.05,42.3 6.05,45.55 4.7,46.9 4.7,48.1 4,48.8 2.31,48.8 JP1.9
EXTI1  (via drill 0.3)
  Top 0.2: U1.82 19,29.1 16.95,31.15 16.95,32.3 14.35,34.9 v13.75,34.9
  InnerBottom 0.2: v13.75,34.9 13.75,37.15 13.35,37.55 12.5,37.55 11.9,38.15 10.75,38.15 6.42,42.48 6.42,45.67 5.1,47 5.1,48.55 JP1.10
EXTI2  (via drill 0.3)
  Top 0.2: U1.83 19.05,29.6 17.25,31.4 17.25,32.7 v15.3,34.65
  InnerBottom 0.2: v15.3,34.65 14.15,35.8 14.15,37.3 13.5,37.95 12.65,37.95 12.05,38.55 10.85,38.55 6.75,42.65 6.75,45.9 5.45,47.2 5.45,48.75 4.8,49.4 4.8,50.75 4.2,51.35 2.3,51.35 JP1.7
EXTI4  (via drill 0.3)
  Top 0.2: U1.85 18.85,30.6 17.65,31.8 17.65,33 v15.25,35.4
  InnerBottom 0.2: v15.25,35.4 15.25,37.45 13.35,39.35 12.1,39.35 10.8,40.65 10.8,41.5 10.45,41.85 8.65,41.85 7.45,43.05 7.45,46.25 6.15,47.55 6.15,49.15 5.55,49.75 5.55,51.3 4.8,52.05 4.8,53.1 4,53.9 2.29,53.9 JP1.5
EXTI6  (via drill 0.3)
  Top 0.2: v16,37.35 16.9,37.35 17.15,37.1 17.15,36.3 19.35,34.1 U1.92
  InnerBottom 0.2: JP1.6 3.59,55.16 5.2,53.55 5.2,52.2 5.95,51.45 5.95,49.9 6.5,49.35 6.5,47.7 7.8,46.4 7.8,43.25 8.8,42.25 10.7,42.25 11.2,41.75 11.2,40.85 12.35,39.7 13.65,39.7 v16,37.35
EXTI7  (via drill 0.3)
  Top 0.2: U1.88 19.25,32.1 15.25,36.1 v14.7,36.1
  InnerBottom 0.2: v14.7,36.1 14.7,37.45 13.2,38.95 11,38.95 7.1,42.85 7.1,46.05 5.8,47.35 5.8,48.95 5.2,49.55 5.2,51 JP1.8
EXTI8  (via drill 0.3)
  Top 0.2: U1.95 18.37,35.6 17.5,36.47 17.5,37.5 v17.15,37.85
  InnerBottom 0.2: JP1.3 2.28,56.45 4.15,56.45 4.8,55.8 4.8,54.55 5.55,53.8 5.55,52.35 6.3,51.6 6.3,50.05 6.8,49.55 6.8,47.9 8.15,46.55 8.15,43.5 9,42.65 10.9,42.65 11.5,42.05 11.5,41.1 12.5,40.1 13.85,40.1 16.1,37.85 v17.15,37.85
EXTI14  (via drill 0.3)
  Top 0.2: U1.8 v17.5,38.55
  InnerBottom 0.2: v17.5,38.55 17.15,38.9 15.65,38.9 14.1,40.45 12.7,40.45 11.85,41.3 11.85,42.35 11.1,43.1 9.1,43.1 8.5,43.7 8.5,46.7 7.15,48.05 7.15,49.7 6.65,50.2 6.65,51.8 5.9,52.55 5.9,54 5.2,54.7 5.2,56.07 JP1.4
GND  (via drill 0.3)
  Top 0.254: U2.11 17.75,6 18.45,6.7 v19.7,6.7 20.9,6.7 21.65,5.95 22.79,5.95 24,7.15 C36.2 | 13.25,18.55 U2.47 | C37.2 13.25,18.55 | 7.9,19.75 9.1,20.95 9.1,21.4 | 9.1,21.4 9.1,22.55 7.9,23.75 C6.2 8.2,24.1 8.2,25.03 8.55,25.38 v8.55,26.15 8.1,26.6 U1.49 | 13.25,18.55 13.25,20.4 12.25,21.4 9.1,21.4 | R1.1 24.24,37.76 24.08,37.6 U1.99 | U1.74 20.5,23.45 v21.05,22.9 | C7.2 6.51,39.74 6.8,39.45 6.8,39.1 v7.3,38.6 7.3,38.13 U1.26
  Top 0.305: C18.- 7.9,19.75
  Bottom 0.254: v19.7,6.7 19.7,15.35 21.3,16.95 21.3,22.4 21.05,22.65 v21.05,22.9
  other vias: 6.09,29.67 12.56,23 15.23,46.69 19.86,49.68 15.19,44.04 17.39,49.68 8.56,56.8 6.22,56.8 24.35,60.87 17.03,41.27 23.9,24.4 8.76,22.9 9.03,26.92 9.78,31.42 15.78,26.47 7.26,22.65 13.28,32.92 16.48,38.37 8.76,53.4 18.64,45.54 10.79,22.99
  pour Top: 0,62 30,62 30,31.3 25.65,31.3 24.7,30.3 24.7,23.9 23.15,22.35 6.1,22.35 5.2,23.25 5.2,30.5 4.3,31.4 0,31.4
  pour InnerBottom: 0,62 30,62 30,31.3 25.65,31.3 24.7,30.3 24.7,23.9 23.15,22.35 6.1,22.35 5.2,23.25 5.2,30.5 4.3,31.4 0,31.4
  pour Bottom: 0,62 30,62 30,31.3 25.65,31.3 24.7,30.3 24.7,23.9 23.15,22.35 6.1,22.35 5.2,23.25 5.2,30.5 4.3,31.4 0,31.4
I2C_SCL  (via drill 0.3)
  Top 0.2: v10.1,28.15 7.32,28.15 U1.46
  InnerBottom 0.2: JP2.23 25.48,32.3 20.78,27.6 11.9,27.6 11.35,28.15 v10.1,28.15
I2C_SDA  (via drill 0.3)
  Top 0.2: v9.65,27.65 9.6,27.6 8.75,27.6 U1.47
  InnerBottom 0.2: JP2.24 27.72,31.05 24.75,31.05 20.95,27.25 11.75,27.25 11.35,27.65 v9.65,27.65
N$2
  Top 0.254: U2.60 7.1,9.1 C28.+
N$6
  Top 0.254: U1.48 5.92,27.1 C13.1
N$12
  Top 0.2: U1.13 15,42.92 14.5,43.42 13.74,43.42 13.11,44.04 Y1.1 12.56,44.52 C23.1
N$15
  Top 0.2: U1.12 15.5,42.92 16.05,43.47 16.82,43.47
  Top 0.254: C22.1 17.88,44.56 Y1.2 17.36,44 16.82,43.47
N$19
  Top 0.254: C14.1 20.01,22.67 20,22.68 U1.73
NRST  (via drill 0.3)
  Top 0.2: U1.14 14.5,42.3 14.15,42.65 12,42.65 11.7,42.95 11.7,47.6 12.2,48.1 22.7,48.1 | 22.7,48.1 v25.2,48.1 | C26.1 22.7,48.1
  Bottom 0.2: J1.10 24.91,48.39 v25.2,48.1
SAI_BCK  (via drill 0.3)
  Top 0.2: U2.36 18.75,17.6 v18.3,18.05 | U1.4 19.5,38.8 19.05,38.35 v19.05,36.65
  Top 0.254: U2.7 15.75,4.45 16,4.15 v17,4.15
  InnerTop 0.2: v19.05,36.65 21.55,34.15 21.55,28 20.65,27.1 18.85,27.1 17.05,25.3 v17.05,20.55
  InnerBottom 0.2: 18.3,13.1 v18.3,18.05 18.3,19.3 v17.05,20.55
  InnerBottom 0.254: 18.3,13.1 17.55,12.35 17.55,4.7 v17,4.15
SAI_LRCK  (via drill 0.3)
  Top 0.2: U2.35 19.25,18.05 v19.05,18.25 | U1.3 20,38.7 19.55,38.25 v19.55,37.15
  Top 0.254: U2.6 15.25,4.15 15.85,3.55 17.25,3.55 17.8,4.1 v18.05,4.1
  InnerTop 0.2: v19.55,37.15 21.95,34.75 21.95,27.9 20.8,26.75 19.05,26.75 17.8,25.5 v17.8,20.6
  InnerBottom 0.2: 19.05,13.01 v19.05,18.25 19.05,19.35 v17.8,20.6
  InnerBottom 0.254: 19.05,13.01 18.05,12.01 v18.05,4.1
SAI_MCLK  (via drill 0.3)
  Top 0.2: U2.41 16.25,17.45 v16.55,17.75 | U1.1 21,38.45 v20.6,38.05
  InnerTop 0.2: v20.6,38.05 22.7,35.95 22.7,27.6 21.15,26.05 19.35,26.05 18.8,25.5 18.8,20 v16.55,17.75
SAI_SDI  (via drill 0.3)
  Top 0.2: U1.5 19,38.95 18.55,38.5 v18.55,36.2
  Top 0.254: U2.8 v16.25,6.65
  InnerTop 0.2: v18.55,36.2 21.2,33.55 21.2,28.15 20.5,27.45 18.6,27.45 16.3,25.15 v16.3,20.5
  InnerBottom 0.2: v16.25,6.65 v16.25,15.5 17.15,16.4 17.15,19.65 v16.3,20.5
SAI_SDO  (via drill 0.3)
  Top 0.2: U2.37 18.25,17.3 17.05,18.5 v16.4,18.5 | U1.2 20.5,38.7 20.05,38.25 v20.05,37.6
  InnerTop 0.2: v20.05,37.6 22.3,35.35 22.3,27.7 21,26.4 19.2,26.4 18.45,25.65 18.45,20.2 16.75,18.5 v16.4,18.5
SPI3_MISO  (via drill 0.3)
  Top 0.2: U1.79 20,27.6 v19.5,28.1
  InnerBottom 0.2: JP2.20 28.97,37.23 27.7,35.96 27.7,34.25 27.25,33.8 25.95,33.8 22.8,30.65 20.75,28.6 20,28.6 v19.5,28.1
SPI3_MOSI  (via drill 0.3)
  Top 0.2: U1.80 21.4,28.1 v20.4,28.1
  InnerBottom 0.2: JP2.22 27.53,33.4 26.1,33.4 20.8,28.1 v20.4,28.1
SPI3_SCK  (via drill 0.3)
  Top 0.2: U1.78 19.5,27.1 18.2,28.4 v18.2,28.45
  InnerBottom 0.2: JP2.18 27.7,38.65 27.7,36.75 27,36.05 26.05,36.05 25.4,35.4 25.4,34.35 20.35,29.3 19.05,29.3 v18.2,28.45
SPI4_MISO  (via drill 0.3)
  Top 0.2: U1.43 8.5,29.6 8.95,29.15 v10.1,29.15
  InnerBottom 0.2: JP2.19 25,35.95 25,34.5 20.1,29.6 18.25,29.6 16.95,28.3 12.25,28.3 11.4,29.15 v10.1,29.15
SPI4_MOSI  (via drill 0.3)
  Top 0.2: U1.44 8.15,29.1 8.6,28.65 v9.65,28.65
  InnerBottom 0.2: v9.65,28.65 11.35,28.65 12.05,27.95 18.5,27.95 19.45,28.9 20.49,28.9 JP2.21
SPI4_SCK  (via drill 0.3)
  Top 0.2: v9.65,29.65 9.05,29.65 8.61,30.09 U1.42
  InnerBottom 0.2: v9.65,29.65 11.4,29.65 12.4,28.65 16.55,28.65 18.5,30.6 20.6,30.6 24.65,34.65 24.65,36.2 25.3,36.85 25.3,37.94 26.43,39.07 JP2.17
SWDCLK  (via drill 0.3)
  Top 0.2: U1.76 v23.8,26.1
  InnerTop 0.2: v24.95,44.65 25.45,44.15 25.45,43.5 24.95,43 24.95,34.45 23.5,33 23.5,26.4 v23.8,26.1
  Bottom 0.2: J1.4 23.52,44.65 v24.95,44.65
SWDIO  (via drill 0.3)
  Top 0.2: U1.72 19.5,25.25 19.75,25.5 v19.75,25.55
  InnerTop 0.2: v19.75,25.55 21.15,25.55 23.1,27.5 23.1,33.1 24.6,34.6 24.6,43.5 v24.95,43.85
  Bottom 0.2: J1.2 24.41,43.31 v24.95,43.85
TIM1_CH1_EXTI9  (via drill 0.3)
  Top 0.2: U1.39 8.7,31.6 8.85,31.75 8.85,35.5 9.8,36.45 9.8,37.15 v6.75,40.2
  InnerBottom 0.2: JP1.11 2.27,46.3 4.25,46.3 5.35,45.2 5.35,41.6 v6.75,40.2
TIM1_CH2_EXTI11  (via drill 0.3)
  Top 0.2: U1.41 8.8,30.6 9.2,31 9.2,35.3 10.15,36.25 10.15,37.5 v7.4,40.25
  InnerBottom 0.2: v7.4,40.25 5.7,41.95 5.7,45.41 JP1.12
TIM2_CH1_EXTI15  (via drill 0.3)
  Top 0.2: U1.77 19.25,26.6 16.25,29.6 16.25,31.95 14.3,33.9 v12.7,33.9
  InnerBottom 0.2: JP1.13 2.28,43.75 4.1,43.75 4.65,43.2 4.65,41.2 5.75,40.1 5.75,38.25 6.9,37.1 11.45,37.1 12.7,35.85 v12.7,33.9
TIM2_CH2_EXTI3  (via drill 0.3)
  Top 0.2: U1.89 19.3,32.6 15.2,36.7 v12.9,36.7
  InnerBottom 0.2: JP1.14 5,43.57 5,41.4 6.15,40.25 6.15,38.35 7.05,37.45 11.6,37.45 12.35,36.7 v12.9,36.7
TIM3_CH1  (via drill 0.3)
  Top 0.2: U1.90 19.3,33.1 15.25,37.15 12.45,37.15 12.2,36.9 v12.2,35.55
  InnerBottom 0.2: v12.2,35.55 11.75,36 6.3,36 5.4,36.9 5.4,39.95 4.15,41.2 2.31,41.2 JP1.17
TIM3_CH2  (via drill 0.3)
  Top 0.2: U1.91 19.35,33.6 16.6,36.35 v16.6,36.85
  InnerBottom 0.2: JP1.18 3.63,39.92 5,38.55 5,36.8 6.15,35.65 11.3,35.65 12.1,34.85 12.1,33.8 12.5,33.4 12.95,33.4 13.6,34.05 15.43,34.05 16.6,35.22 v16.6,36.85
TIM4_CH1  (via drill 0.3)
  Top 0.2: v11.05,35.15 11.05,32.55 13.15,30.45 13.15,26.56 13,26.41 U1.59
  InnerBottom 0.2: JP1.19 2.3,38.65 4.05,38.65 4.6,38.1 4.6,36.7 6.15,35.15 10.5,35.15 v11.05,35.15
TIM4_CH2  (via drill 0.3)
  Top 0.2: U1.60 13.5,30.65 11.55,32.6 v11.55,34.65
  InnerBottom 0.2: JP1.20 3.57,37.18 6.1,34.65 v11.55,34.65
TIM5_CH1  (via drill 0.3)
  Top 0.2: U1.22 10.5,38.74 11.05,38.19 11.05,35.8 10.5,35.25 v10.5,33.7
  InnerBottom 0.2: JP1.21 2.34,36.15 4,36.15 5.85,34.3 9.9,34.3 v10.5,33.7
TIM5_CH2  (via drill 0.3)
  Top 0.2: U1.23 10,38.69 10.71,37.99 10.71,36.01 9.85,35.15 v9.85,33.6
  InnerBottom 0.2: JP1.22 3.6,34.84 4.5,33.94 9.51,33.94 v9.85,33.6
TIM8_CH1  (via drill 0.3)
  Top 0.2: U1.63 15,25.45 13.85,26.6 13.85,30.8 12.1,32.55 v12.1,32.8
  InnerBottom 0.2: JP1.23 1.93,32.3 3.08,33.45 9.25,33.45 9.9,32.8 v12.1,32.8
TIM8_CH2  (via drill 0.3)
  Top 0.2: U1.64 15.5,25.64 14.15,27 14.15,31.25 v13.25,32.15
  InnerBottom 0.2: JP1.24 4.27,33 9.15,33 10,32.15 v13.25,32.15
UART2_RX  (via drill 0.3)
  Top 0.2: U1.87 v20.3,31.6
  InnerBottom 0.2: JP2.15 24.45,40.48 24.45,37.15 23.15,35.85 23.15,34.4 20.35,31.6 v20.3,31.6
UART2_TX  (via drill 0.3)
  Top 0.2: U1.86 19.5,31.1 v18.55,32.05
  InnerBottom 0.2: JP2.13 26.43,44.6 23.75,41.92 23.75,37.6 22.4,36.25 22.4,35.9 v18.55,32.05
UART3_RX  (via drill 0.3)
  Top 0.2: U1.56 11.5,25.61 12.65,26.75 v12.65,29.2
  InnerBottom 0.2: JP2.16 27.71,41.2 25.75,41.2 24.85,40.3 24.85,37 23.55,35.7 23.55,34.1 20.45,31 18.15,31 16.35,29.2 v12.65,29.2
UART3_TX  (via drill 0.3)
  Top 0.2: U1.55 11,25.61 12.15,26.75 v12.15,29.7
  InnerBottom 0.2: JP2.14 27.72,43.75 26.15,43.75 24.1,41.7 24.1,37.4 22.75,36.05 22.75,35.2 19,31.45 17.85,31.45 16.1,29.7 v12.15,29.7
USBD_D+  (via drill 0.3)
  Top 0.2: CN1.3 v15,56.15 | v25.15,55.05 25.15,53.9 JP2.7 | U1.71 19,26.3 15.9,29.4 15.9,31.4 v15.45,31.85
  InnerBottom 0.2: v15,56.15 15.05,56.2 15.8,56.2 16.6,55.4 24.8,55.4 v25.15,55.05 | JP2.7 24.85,51.04 24.85,50.4 22.35,47.9 22.35,40 21.5,39.15 21.5,37.6 16.1,32.2 15.8,32.2 v15.45,31.85
USBD_D-  (via drill 0.3)
  Top 0.2: CN1.2 v14.35,56.3 | JP2.5 25.84,55.75 25,55.75 24.1,54.85 v24.1,53.3 | U1.70 18.5,26.3 15.55,29.25 15.55,30.95 14.95,31.55 14.95,32.4 v14.5,32.85
  InnerBottom 0.2: v14.35,56.3 14.7,56.65 15.9,56.65 16.8,55.75 25.84,55.75 JP2.5 | v24.1,53.3 24.1,53.25 23.75,52.9 23.75,50.95 21.25,48.45 21.25,40.5 17.5,36.75 17.5,35.2 15.6,33.3 14.95,33.3 v14.5,32.85
USBD_ID  (via drill 0.3)
  Top 0.2: CN1.4 v15.65,55.7 | v24.6,54.65 24.6,51.91 JP2.9 | v15.05,30.7 15.05,29.2 18,26.24 U1.69
  InnerBottom 0.2: v15.65,55.7 16.35,55 24.25,55 v24.6,54.65 | JP2.9 25.63,50.08 23.05,47.5 23.05,38 15.75,30.7 v15.05,30.7
USBD_VBUS  (via drill 0.3)
  Top 0.2: CN1.1 v13.7,56.3 | v13.95,32.35 14.55,31.75 14.55,29.12 17.5,26.16 U1.68 | v23.35,53.75 23.35,54.62 JP2.3
  InnerBottom 0.2: v13.7,56.3 13.7,56.7 14.05,57.05 16,57.05 16.95,56.1 24.83,56.1 JP2.3 | v23.35,53.75 23.35,51.1 20.9,48.65 20.9,40.65 17.15,36.9 17.15,35.35 15.5,33.7 14.6,33.7 13.95,33.05 v13.95,32.35
USBH_D+  (via drill 0.3)
  Top 0.2: U1.54 10.5,25.66 11.7,26.85 11.7,30.4 v12.05,30.75
  InnerBottom 0.2: JP2.8 27.75,51.4 25.9,51.4 25.2,50.7 25.2,50.25 22.7,47.75 22.7,39.75 21.9,38.95 21.9,37.47 15.68,31.25 14.75,31.25 14.25,30.75 v12.05,30.75
USBH_D-  (via drill 0.3)
  Top 0.2: U1.53 10,25.75 11.3,27.05 v11.3,30.95
  InnerBottom 0.2: JP2.6 27.46,53.65 25.8,53.65 24.45,52.3 24.45,50.55 21.95,48.05 21.95,40.15 21.15,39.35 21.15,37.8 15.95,32.6 15.45,32.6 14.1,31.25 11.6,31.25 v11.3,30.95
USBH_ID  (via drill 0.3)
  Top 0.2: U1.51 9,25.86 10.6,27.45 10.55,27.5 10.55,29.89 v10.25,30.19 v10.25,30.2
  InnerBottom 0.2: JP2.10 27.69,48.8 24.9,48.8 23.4,47.3 23.4,37.67 15.93,30.2 v10.25,30.2
USBH_VBUS  (via drill 0.3)
  Top 0.2: U1.52 9.5,25.8 10.95,27.25 10.95,30.55 v10.55,30.95
  InnerBottom 0.2: v10.55,30.95 11.2,31.6 13.95,31.6 15.3,32.95 15.75,32.95 17.85,35.05 17.85,36.55 21.6,40.3 21.6,48.25 24.1,50.75 24.1,52.6 25.5,54 27.15,54 27.7,54.55 27.7,56.43 JP2.4
VREF_ADC
  Top 0.254: U2.59 8.15,9.6 7.35,10.4 7.35,10.8 C29.+

### Text on the board
bPlace: 2 1 | 96 95 | 3 | 94 | 5 | 92 | 7 | 90 | 9 | 88 | 11 | 13 | 15 | 17 | 80 | 19 | 21 | 76 | 23 | 74 | 25 | 72 | 27 | 70 | 29 | 68 | 31 | 66 | 33 | 64 | Noctua2 Rev01 | 35 | 62 | 37 | 60 | 39 | 58 | 41 | 56 | 43 | 54 | 45 | 52 | 48 47 | 50 49